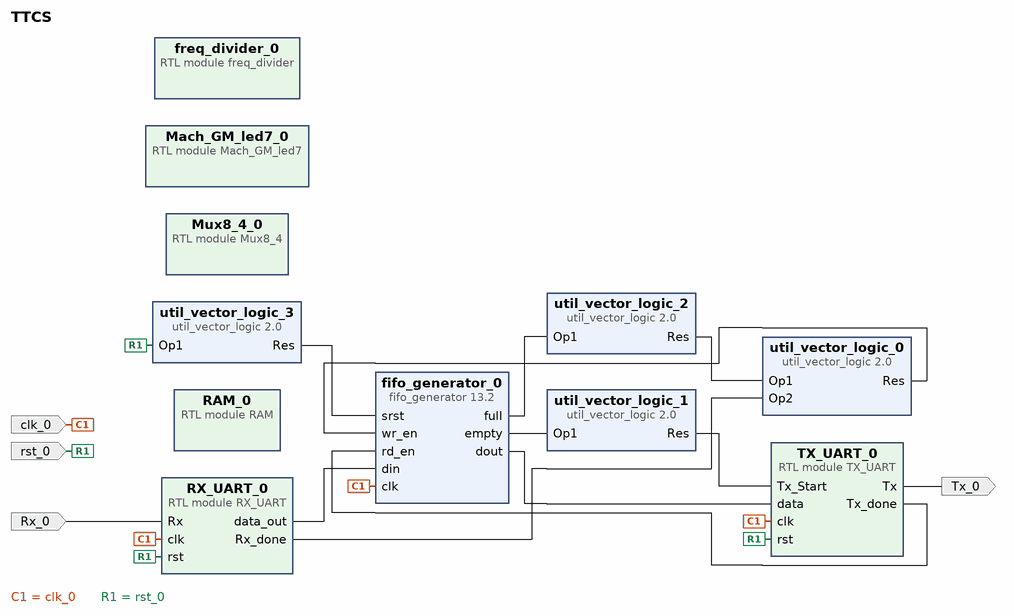
[diagram p0: block diagram of the top level]
# Vivado block design TTCS, xc7a35ticsg324-1L, Vivado 2020.2.2
create_bd_design TTCS

create_bd_port -dir I -type clk clk_0
create_bd_port -dir I -type rst rst_0
create_bd_port -dir O Tx_0
create_bd_port -dir I Rx_0

create_bd_cell -type ip -vlnv xilinx.com:ip:fifo_generator:13.2 fifo_generator_0
set_property -dict {CONFIG.Data_Count false CONFIG.Input_Data_Width 8 CONFIG.Output_Data_Width 8} [get_bd_cells fifo_generator_0]
create_bd_cell -type ip -vlnv xilinx.com:ip:util_vector_logic:2.0 util_vector_logic_0
set_property -dict {CONFIG.C_SIZE 1} [get_bd_cells util_vector_logic_0]
create_bd_cell -type ip -vlnv xilinx.com:ip:util_vector_logic:2.0 util_vector_logic_1
set_property -dict {CONFIG.C_OPERATION not CONFIG.C_SIZE 1} [get_bd_cells util_vector_logic_1]
create_bd_cell -type ip -vlnv xilinx.com:ip:util_vector_logic:2.0 util_vector_logic_2
set_property -dict {CONFIG.C_OPERATION not CONFIG.C_SIZE 1} [get_bd_cells util_vector_logic_2]
create_bd_cell -type ip -vlnv xilinx.com:ip:util_vector_logic:2.0 util_vector_logic_3
set_property -dict {CONFIG.C_OPERATION not CONFIG.C_SIZE 1} [get_bd_cells util_vector_logic_3]
create_bd_cell -type module -reference TX_UART TX_UART_0
create_bd_cell -type module -reference RX_UART RX_UART_0
create_bd_cell -type module -reference RAM RAM_0
create_bd_cell -type module -reference Mux8_4 Mux8_4_0
create_bd_cell -type module -reference Mach_GM_led7 Mach_GM_led7_0
create_bd_cell -type module -reference freq_divider freq_divider_0

# ---- connections ----

connect_bd_net -net Rx_0_1 [get_bd_ports Rx_0] [get_bd_pins RX_UART_0/Rx]
connect_bd_net [get_bd_pins TX_UART_0/Tx] [get_bd_ports Tx_0]
connect_bd_net [get_bd_pins fifo_generator_0/dout] [get_bd_pins TX_UART_0/data]
connect_bd_net [get_bd_pins util_vector_logic_2/Res] [get_bd_pins util_vector_logic_0/Op1]
connect_bd_net [get_bd_pins RX_UART_0/Rx_done] [get_bd_pins util_vector_logic_0/Op2]
connect_bd_net [get_bd_pins util_vector_logic_0/Res] [get_bd_pins fifo_generator_0/wr_en]
connect_bd_net [get_bd_pins fifo_generator_0/full] [get_bd_pins util_vector_logic_2/Op1]
connect_bd_net -net clk_0_1 [get_bd_ports clk_0] [get_bd_pins fifo_generator_0/clk] [get_bd_pins TX_UART_0/clk] [get_bd_pins RX_UART_0/clk]
connect_bd_net [get_bd_pins RX_UART_0/data_out] [get_bd_pins fifo_generator_0/din]
connect_bd_net [get_bd_pins util_vector_logic_3/Res] [get_bd_pins fifo_generator_0/srst]
connect_bd_net -net rst_0_1 [get_bd_ports rst_0] [get_bd_pins util_vector_logic_3/Op1] [get_bd_pins TX_UART_0/rst] [get_bd_pins RX_UART_0/rst]
connect_bd_net [get_bd_pins fifo_generator_0/empty] [get_bd_pins util_vector_logic_1/Op1]
connect_bd_net [get_bd_pins TX_UART_0/Tx_done] [get_bd_pins fifo_generator_0/rd_en]
connect_bd_net [get_bd_pins util_vector_logic_1/Res] [get_bd_pins TX_UART_0/Tx_Start]

validate_bd_design
save_bd_design
